# EAGLE design 520_servo_pwm (EAGLE 9.6.2)
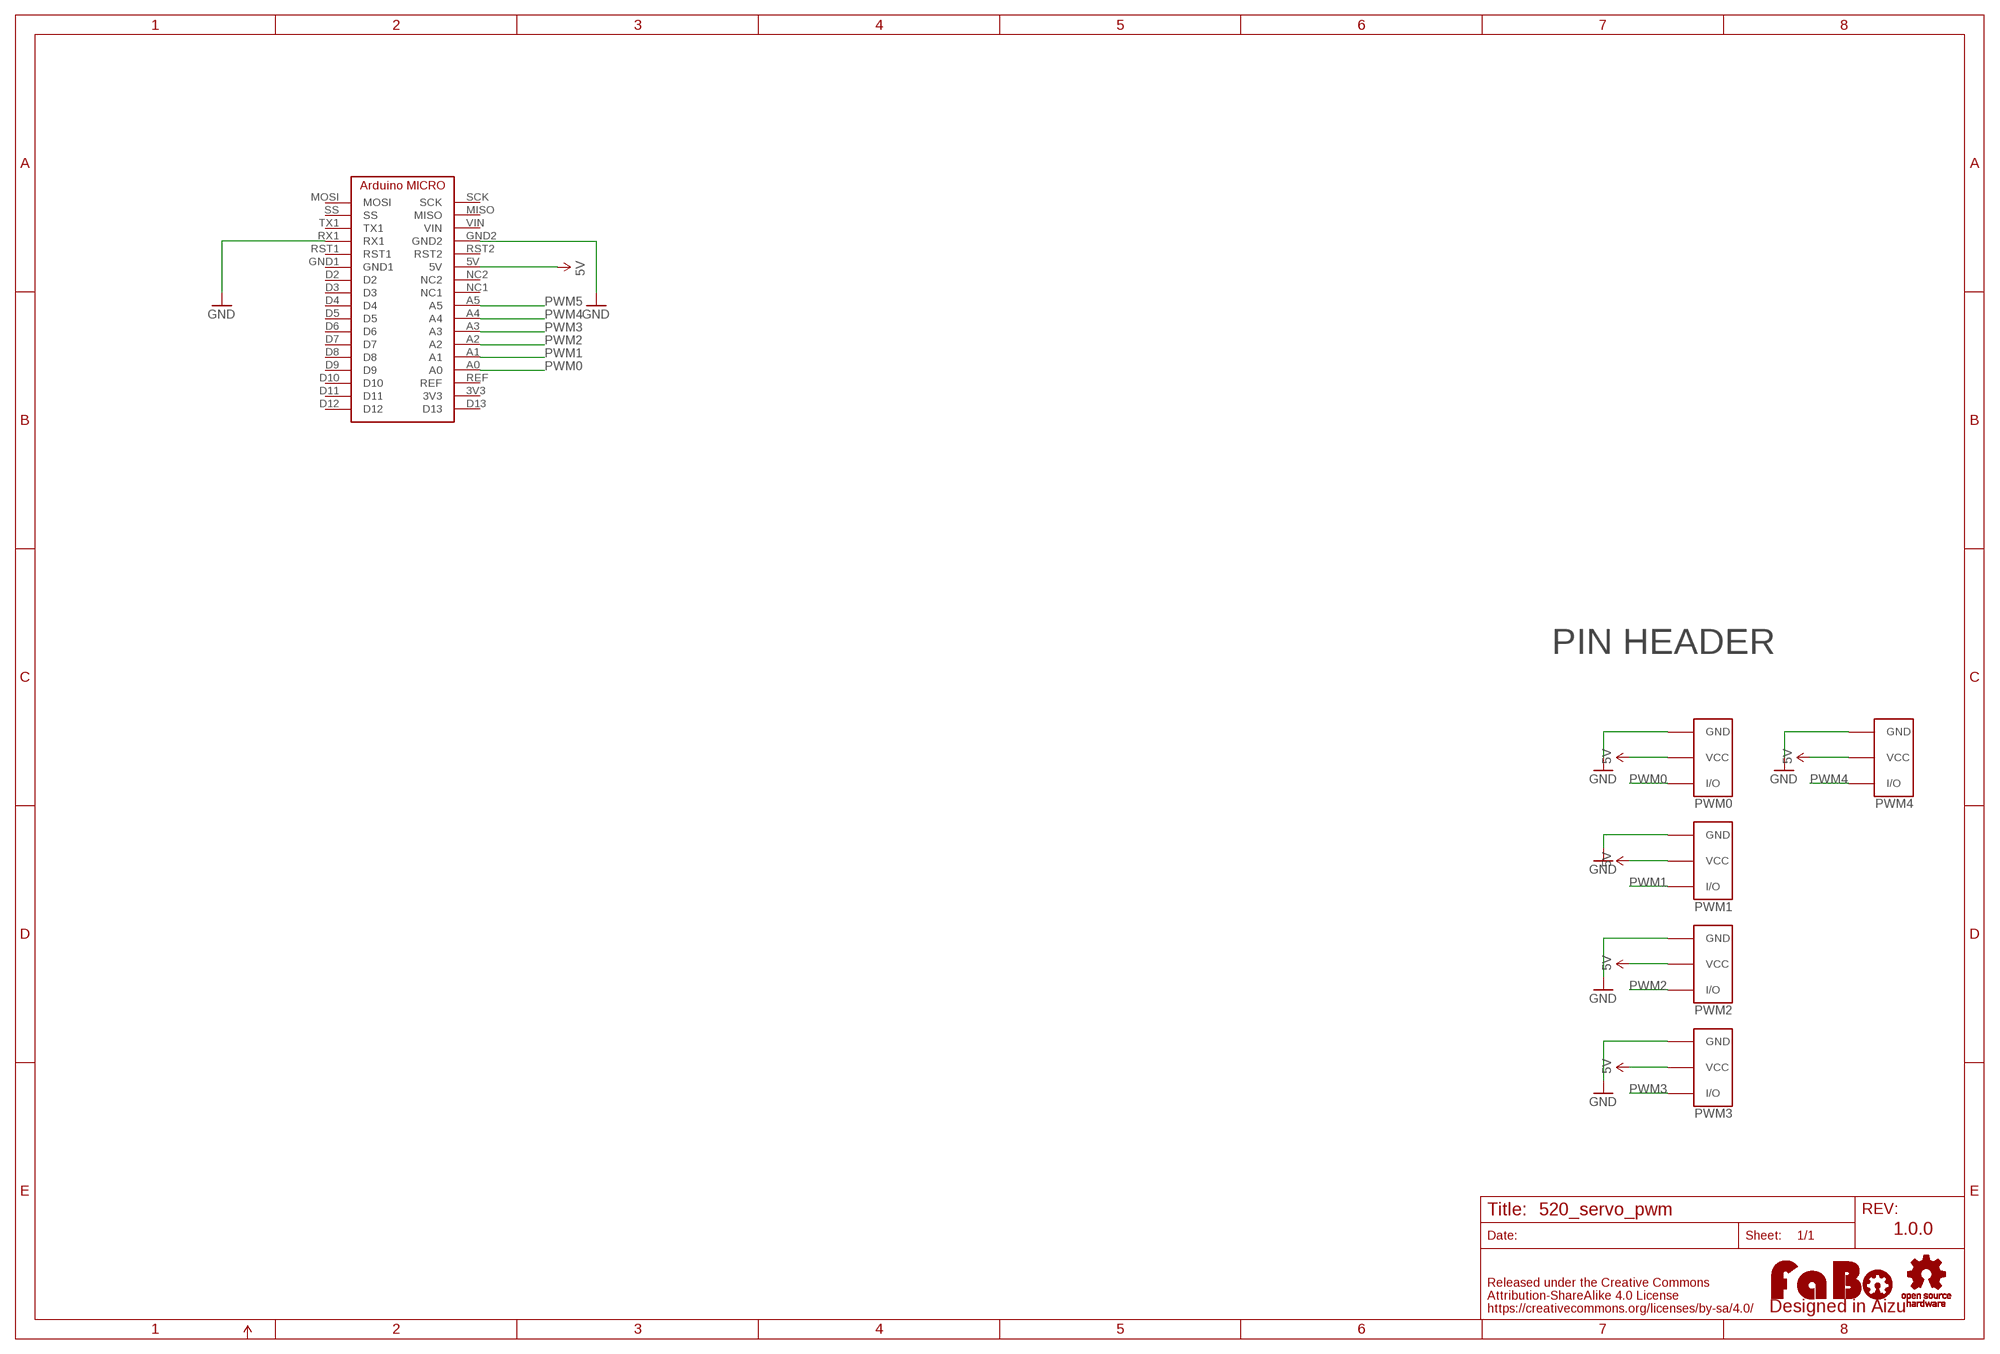
[diagram p0: schematic, sheet 1]

## Parts
LOGO1  LOGO_FABO-M_BOTTOM  [LOGO_FABO_M_BOTTOM]
PWM0  FABO_BRICK_3PIN-HEADER  [FABO_BRICK_3PIN_HEADER]
PWM1  FABO_BRICK_3PIN-HEADER  [FABO_BRICK_3PIN_HEADER]
PWM2  FABO_BRICK_3PIN-HEADER  [FABO_BRICK_3PIN_HEADER]
PWM3  FABO_BRICK_3PIN-HEADER  [FABO_BRICK_3PIN_HEADER]
PWM4  FABO_BRICK_3PIN-HEADER  [FABO_BRICK_3PIN_HEADER]
U$2  ARDUINO_MICRO  [ARDUINO_MICRO]
U$3  LOGO_OSHW-M_BOTTOM  [LOGO_OSHW_M_BOTTOM]

## Nets
5V: PWM0.VCC PWM1.VCC PWM2.VCC PWM3.VCC PWM4.VCC U$2.5V
GND: PWM0.GND PWM1.GND PWM2.GND PWM3.GND PWM4.GND U$2.GND2 U$2.RX1
PWM0: PWM0.I/O U$2.A0
PWM1: PWM1.I/O U$2.A1
PWM2: PWM2.I/O U$2.A2
PWM3: PWM3.I/O U$2.A3
PWM4: PWM4.I/O U$2.A4
PWM5: U$2.A5
Unconnected: U$2.3V3 U$2.D2 U$2.D3 U$2.D4 U$2.D5 U$2.D6 U$2.D7 U$2.D8 U$2.D9 U$2.D10 U$2.D11 U$2.D12 U$2.D13 U$2.GND1 U$2.MISO U$2.MOSI U$2.NC1 U$2.NC2 U$2.REF U$2.RST1 U$2.RST2 U$2.SCK U$2.SS U$2.TX1 U$2.VIN

## Notes on the sheet
- PIN HEADER
- 1.0.0

## Library data of the parts
LOGO1 = component:LOGO_FABO
PWM0 PWM1-PWM4 = FaBo-Template:FABO_BRICK_3PIN: FaBo Brick 3pin
U$2 = FaBo-Boards:ARDUINO_MICRO
U$3 = component:LOGO_OSHW

## Board
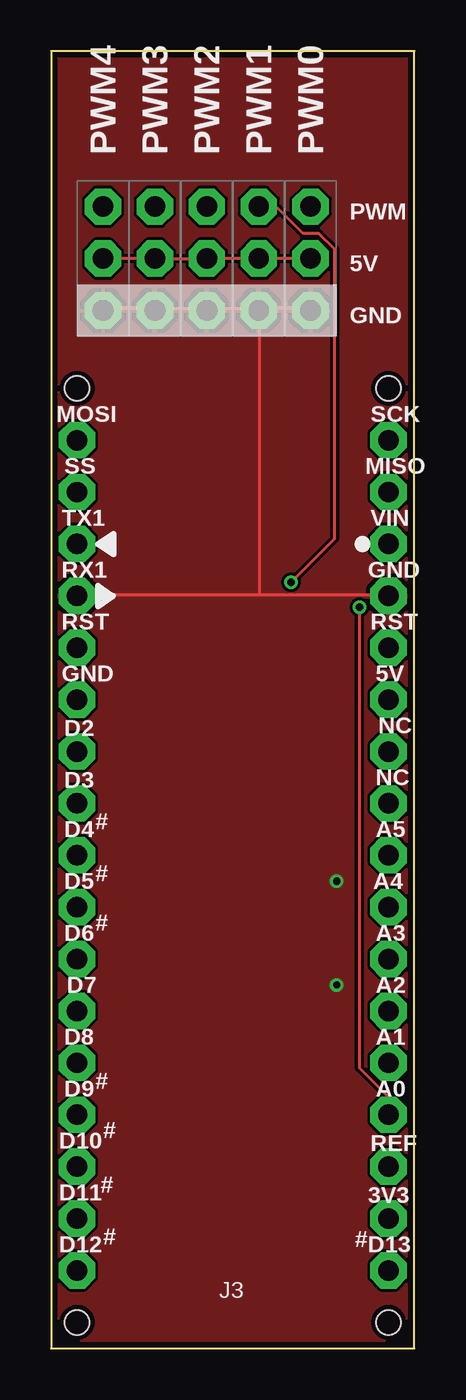
[diagram p1: board, top side]
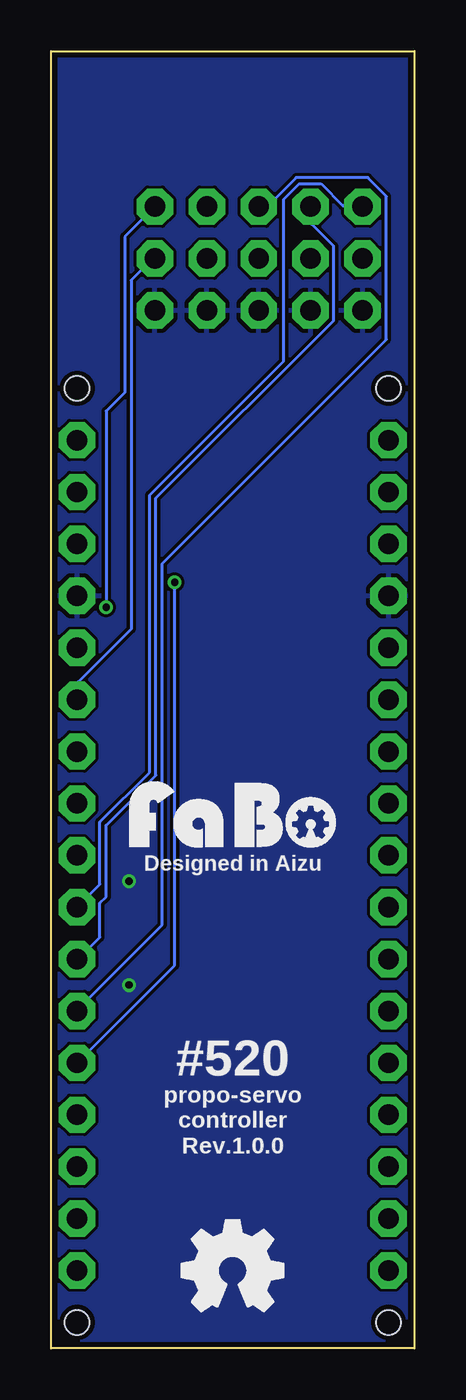
[diagram p2: board, bottom side, seen from below]

Size 17.78 x 63.5 mm. Coordinates in mm from the lower left corner, seen from the top.
Copper layers (1*16): Top 0.035mm / dielectric 1.6mm / Bottom 0.035mm
Design rules "PCBway": minimum track width 6mil, minimum drill 12mil, track to track 6mil, track to pad 6mil, pad to pad 6mil, via to via 6mil, smd to smd 6mil, copper to edge 10mil, drill to drill 10mil, minimum pad ring 10mil, minimum via ring 6mil, stop-mask expansion 2mil, vias tented up to drill 100mil, thermal gap 8mil

### Footprints (pad centres in the part's own frame; a part is rotated, then mirrored left to right if it is on the bottom)
FABO_BRICK_3PIN_HEADER = drill 1 pad 1.778 octagon: GND -2.54,0; I/O 2.54,0; VCC 0,0
ARDUINO_MICRO = drill 1 pad 1.778 octagon: 3V3 16.51,6.35; 5V 16.51,31.75; A0 16.51,11.43; A1 16.51,13.97; A2 16.51,16.51; A3 16.51,19.05; A4 16.51,21.59; A5 16.51,24.13; D2 1.27,29.21; D3 1.27,26.67; D4 1.27,24.13; D5 1.27,21.59; D6 1.27,19.05; D7 1.27,16.51; D8 1.27,13.97; D9 1.27,11.43; D10 1.27,8.89; D11 1.27,6.35; D12 1.27,3.81; D13 16.51,3.81; GND1 1.27,31.75; GND2 16.51,36.83; MISO 16.51,41.91; MOSI 1.27,44.45; NC1 16.51,26.67; NC2 16.51,29.21; REF 16.51,8.89; RST1 1.27,34.29; RST2 16.51,34.29; RX1 1.27,36.83; SCK 16.51,44.45; SS 1.27,41.91; TX1 1.27,39.37; VIN 16.51,39.37 | hole 1.2: 1.27,1.264; 16.51,1.264; 1.27,46.984; 16.51,46.984

### Placement (x,y rotation side)
LOGO1  8.89,24.14 0 top
PWM0  12.7,53.35 90 top
PWM1  10.16,53.35 90 top
PWM2  7.62,53.35 90 top
PWM3  5.08,53.35 90 top
PWM4  2.54,53.35 90 top
U$2  0,0.01 0 top
U$3  8.89,3.82 0 top

### Tracks (layer width: path | path; a pad name or v marks a point on that pad's centre or on a via)
5V
  Top 0.152: PWM4.VCC PWM3.VCC PWM2.VCC PWM1.VCC PWM0.VCC
  Bottom 0.152: U$2.5V 16.46,31.86 16.46,32.62 13.87,35.21 13.87,52.28 12.8,53.35 PWM0.VCC
GND  (via drill 0.35)
  Top 0.152: PWM1.GND 10.21,50.91 12.65,50.91 PWM0.GND | PWM4.GND 2.59,50.91 5.03,50.91 PWM3.GND 5.18,50.91 7.62,50.91 | 7.62,50.91 10.06,50.91 PWM1.GND | 7.62,50.91 PWM2.GND | 10.21,36.89 16.46,36.89 U$2.GND2 | 10.21,36.89 1.37,36.89 U$2.RX1 | 10.21,36.89 10.21,50.76 PWM1.GND
  other vias: 13.97,22.87 13.97,17.79
  pour Bottom: 0,0.01 0,63.51 17.78,63.51 17.78,0.01
  pour Top: 0,0.01 0,63.51 17.78,63.51 17.78,0.01
PWM0  (via drill 0.35)
  Top 0.152: v15.09,36.28 15.09,13.72 16.46,12.35 16.46,11.44 U$2.A0
  Bottom 0.152: v15.09,36.28 15.09,45.88 14.17,46.79 14.17,54.41 PWM0.I/O
PWM1  (via drill 0.35)
  Top 0.152: v11.73,37.5 13.87,39.63 13.87,53.8 13.11,54.57 12.34,54.57 11.12,55.78 10.21,55.78 PWM1.I/O
  Bottom 0.152: v11.73,37.5 11.73,18.75 U$2.A1
PWM2
  Bottom 0.152: PWM2.I/O 7.62,55.94 7.16,55.94 5.79,57.31 2.29,57.31 1.37,56.39 1.37,49.38 12.34,38.41 12.34,20.73 16.46,16.62 U$2.A2
PWM3
  Bottom 0.152: PWM3.I/O 5.03,55.78 5.03,55.02 3.96,53.96 3.96,50.3 12.65,41.61 12.65,28.05 15.09,25.61 15.09,22.1 15.39,21.8 15.39,20.12 16.46,19.06 U$2.A3
PWM4
  Bottom 0.152: U$2.A4 15.39,22.71 15.39,25.76 12.95,28.2 12.95,41.76 6.4,48.32 6.4,56.24 5.64,57 4.57,57 3.5,55.94 2.59,55.94 PWM4.I/O

### Text on the board
tPlace: PWM | 5V | GND
bPlace: Designed in Aizu | #520 | propo-servo / controller | Rev.1.0.0